# EAGLE schematic Moisture_Probe (EAGLE 9.3.2)
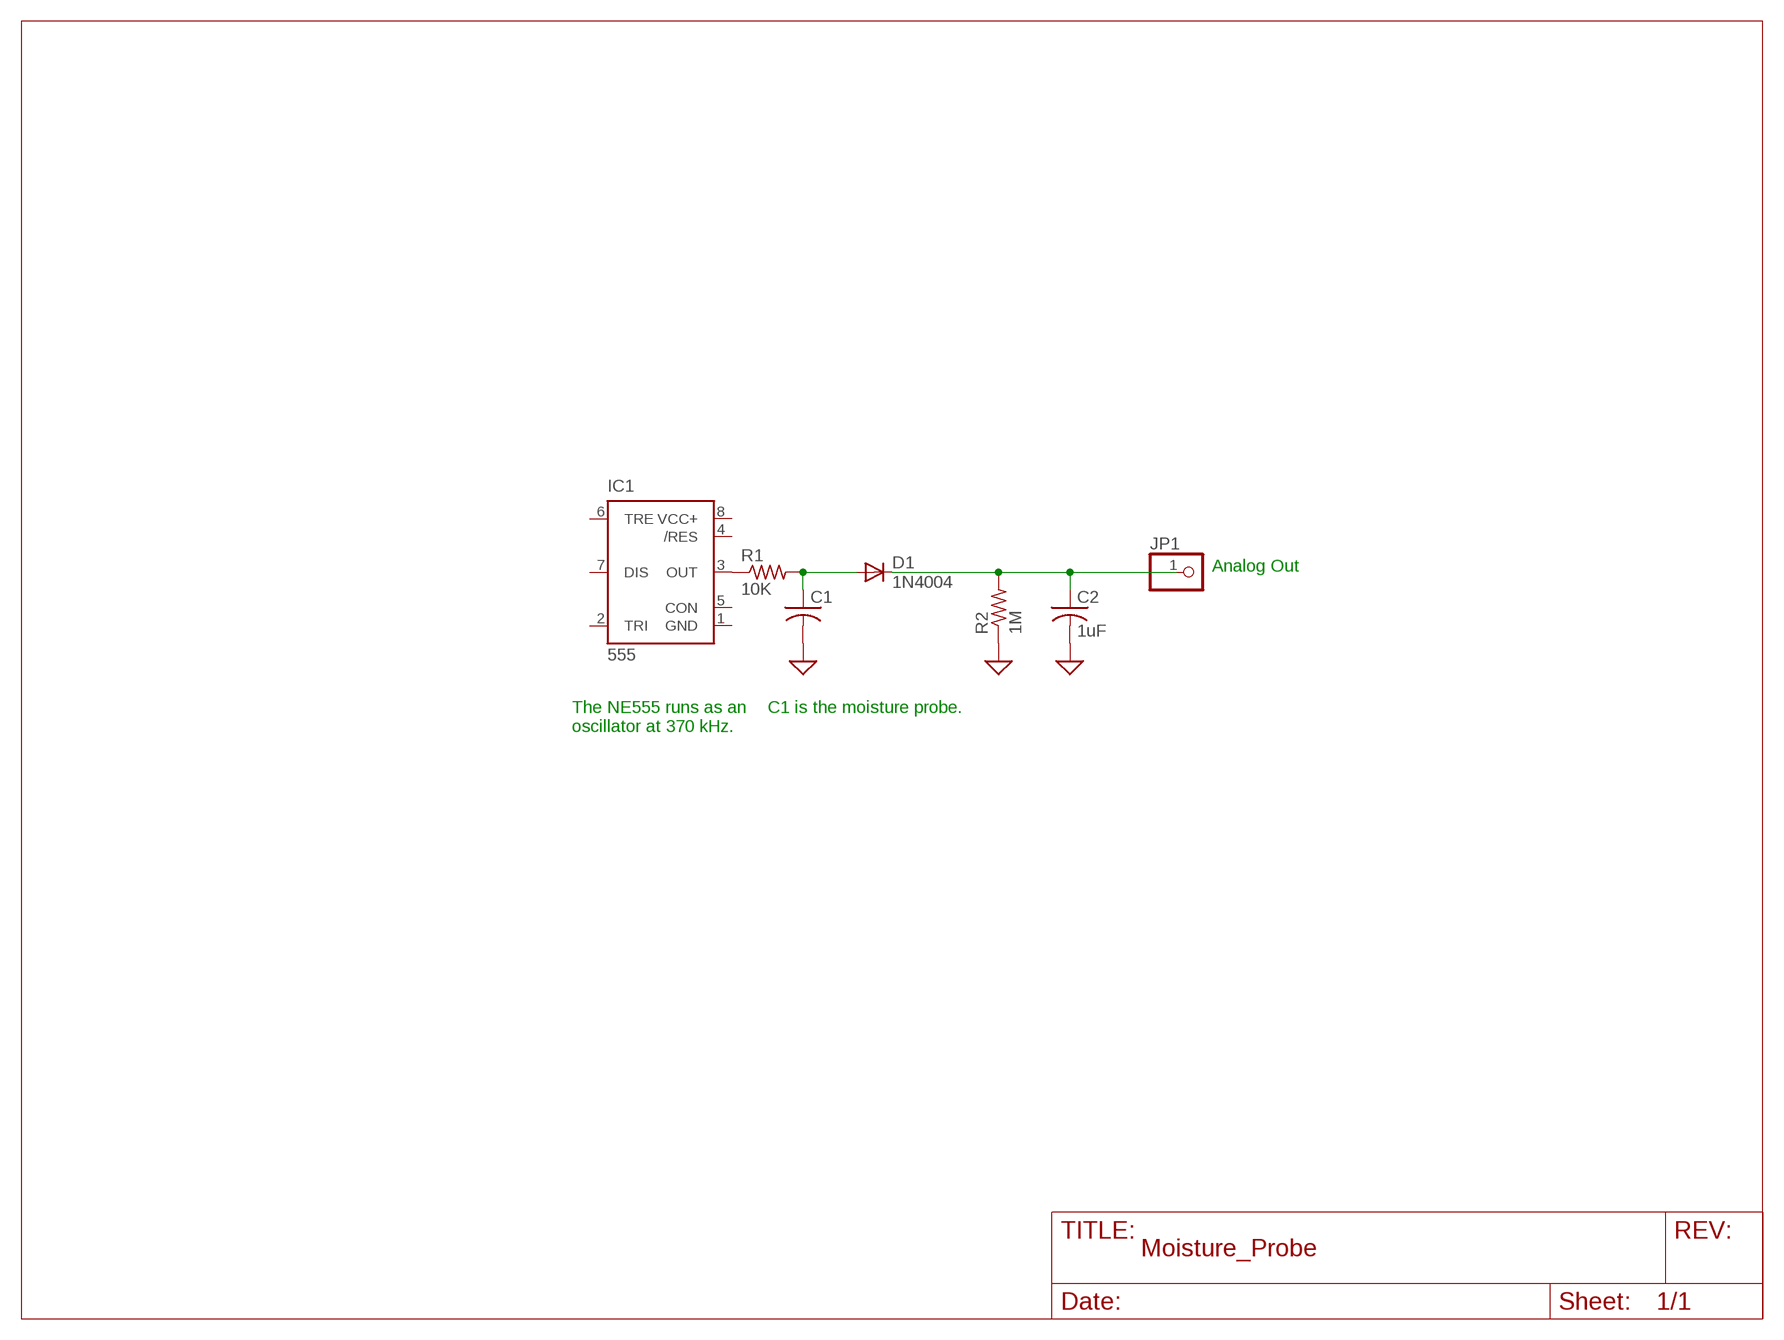
[diagram p0: schematic, sheet 1]

## Parts
C1  C-US050-030X075  [C050-030X075]
C2  1uF  C-US050-030X075  [C050-030X075]
D1  1N4004  [DO41-10]
IC1  555  555P  [DIP08]
JP1  PINHD-1X1  [1X01]
R1  10K  R-US_0204/7  [0204/7]
R2  1M  R-US_0204/7  [0204/7]

## Nets
GND: C1.2 C2.2 R2.1 ; supply symbol labelled SUP
N$1: IC1.3(OUT) R1.1
N$2: C1.1 D1.A R1.2
N$3: C2.1 D1.C JP1.1 R2.2
Unconnected: IC1.2(TRI) IC1.4(/RES) IC1.5(CON) IC1.6(TRE) IC1.7(DIS)

## Notes on the sheet
- Analog Out
- C1 is the moisture probe.
- The NE555 runs as an
  oscillator at 370 kHz.

## Power pins joined to a net without a drawn wire
GND: IC1.1(GND)
VCC+: IC1.8(VCC+)

## Library data of the parts
C1 C2 = adafruit:C-US: CAPACITOR, American symbol
D1 = adafruit:1N4004: DIODE General purpose 1N400x type rectifier (With bigger pads) http://www.ladyada.net/library/pcb/eaglelibrary.html
IC1 = SparkFun-IC-Special-Function:555: General purpose bipolar Timer Datasheet <http://www.sparkfun.com/datasheets/Components/General/ne555.pdf> SparkFun Products SparkFun SparkPunk Sequencer Kit <https://www.sparkfun.com/products/12707> (KIT-12707) Storefront Component: 555 Timer <https://www.sparkfun.com/products/9273> (COM-09273) Two parts valid for production: VFP: IC-11930 (M7555 PTH) VFP: IC-09173 (555 PTH) - Preferred; PROD_ID: IC-09173; PROD_ID_ALT: IC-09173
JP1 = adafruit:PINHD-1X1: Pin header 1x1 for 0.1" spacing With round pins
R1 R2 = adafruit:R-US_: RESISTOR, American symbol